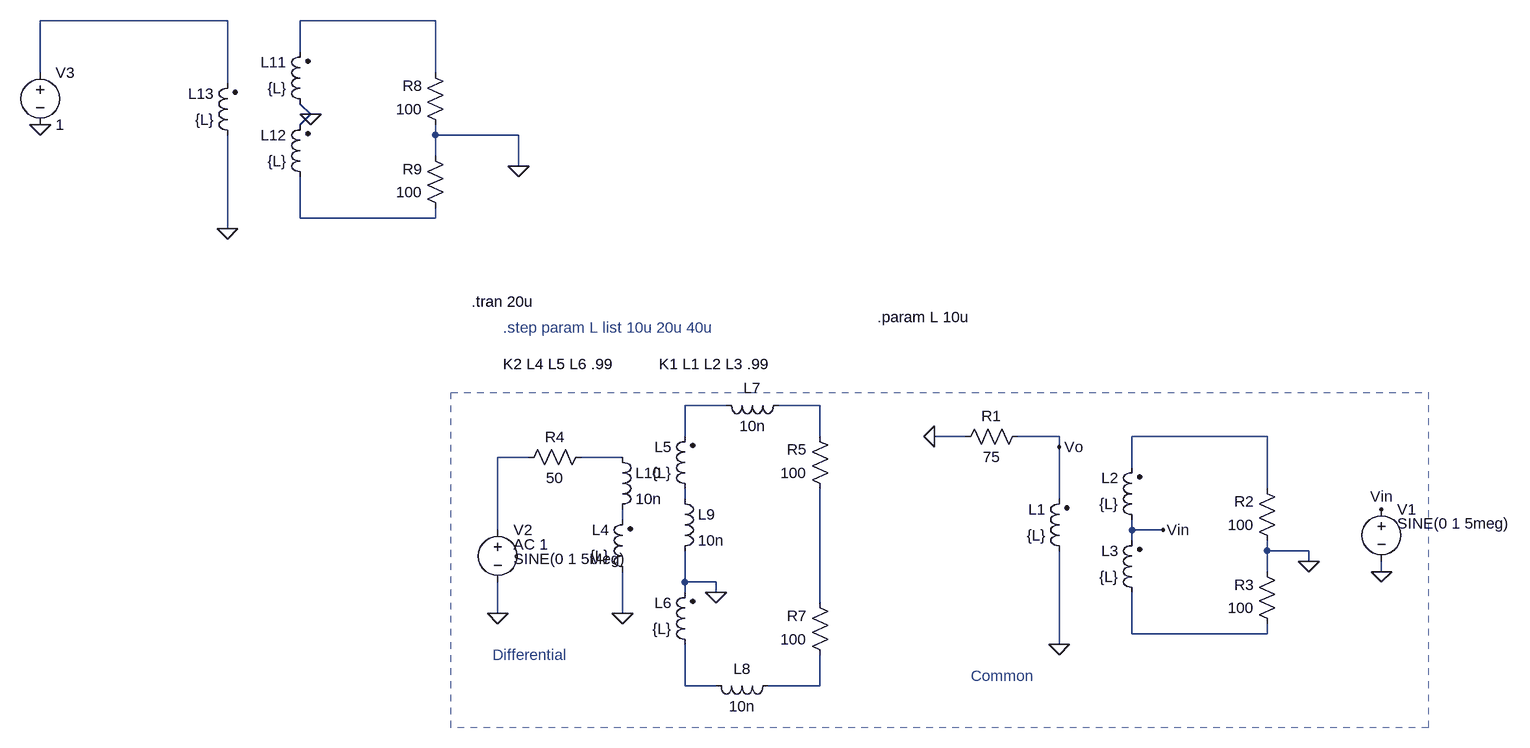
[diagram p0: schematic Trifilar.asc]
Trifilar.asc, the LTspice schematic file:
Version 4
SHEET 1 880 912
WIRE -1184 -592 -1472 -592
WIRE -864 -592 -1072 -592
WIRE -1072 -544 -1072 -592
WIRE -1472 -512 -1472 -592
WIRE -864 -512 -864 -592
WIRE -1184 -496 -1184 -592
WIRE -1056 -448 -1072 -464
WIRE -1072 -432 -1056 -448
WIRE -864 -416 -864 -432
WIRE -736 -416 -864 -416
WIRE -864 -384 -864 -416
WIRE -736 -368 -736 -416
WIRE -1072 -288 -1072 -352
WIRE -864 -288 -864 -304
WIRE -864 -288 -1072 -288
WIRE -1184 -272 -1184 -416
WIRE -416 0 -480 0
WIRE -272 0 -336 0
WIRE -480 48 -480 0
WIRE -272 48 -272 0
WIRE -48 48 -96 48
WIRE 96 48 32 48
WIRE 416 48 208 48
WIRE 96 64 96 48
WIRE -720 80 -768 80
WIRE -576 80 -640 80
WIRE 208 96 208 48
WIRE 416 128 416 48
WIRE -480 144 -480 128
WIRE 96 144 96 64
WIRE -576 176 -576 160
WIRE -768 192 -768 80
WIRE 208 192 208 176
WIRE 256 192 208 192
WIRE 208 208 208 192
WIRE 416 224 416 208
WIRE 480 224 416 224
WIRE 480 240 480 224
WIRE 416 256 416 224
WIRE 592 256 592 240
WIRE -480 272 -480 224
WIRE -432 272 -480 272
WIRE -480 288 -480 272
WIRE -432 288 -432 272
WIRE -272 304 -272 128
WIRE -768 320 -768 272
WIRE -576 320 -576 256
WIRE 208 352 208 288
WIRE 416 352 416 336
WIRE 416 352 208 352
WIRE 96 368 96 224
WIRE -480 432 -480 368
WIRE -432 432 -480 432
WIRE -272 432 -272 384
WIRE -272 432 -352 432
FLAG 592 256 0
FLAG 96 368 0
FLAG -768 320 0
FLAG -576 320 0
FLAG 592 160 Vin
FLAG 256 192 Vin
FLAG 480 240 0
FLAG -96 48 0
FLAG -432 288 0
FLAG 96 64 Vo
FLAG -1184 -272 0
FLAG -1472 -432 0
FLAG -736 -368 0
FLAG -1056 -448 0
SYMBOL ind2 224 192 R180
WINDOW 0 36 80 Left 2
WINDOW 3 36 40 Left 2
SYMATTR InstName L2
SYMATTR Value {L}
SYMATTR Type ind
SYMBOL ind2 224 304 R180
WINDOW 0 36 80 Left 2
WINDOW 3 36 40 Left 2
SYMATTR InstName L3
SYMATTR Value {L}
SYMATTR Type ind
SYMBOL voltage 592 144 R0
WINDOW 3 24 38 Left 2
SYMATTR Value SINE(0 1 5meg)
SYMATTR InstName V1
SYMATTR Value2 AC 1
SYMATTR SpiceLine Rser=50
SYMBOL res 48 32 R90
WINDOW 0 0 56 VBottom 2
WINDOW 3 32 56 VTop 2
SYMATTR InstName R1
SYMATTR Value 75
SYMBOL res 432 224 R180
WINDOW 0 36 76 Left 2
WINDOW 3 36 40 Left 2
SYMATTR InstName R2
SYMATTR Value 100
SYMBOL res 432 352 R180
WINDOW 0 36 76 Left 2
WINDOW 3 36 40 Left 2
SYMATTR InstName R3
SYMATTR Value 100
SYMBOL ind2 -464 144 R180
WINDOW 0 36 80 Left 2
WINDOW 3 36 40 Left 2
SYMATTR InstName L5
SYMATTR Value {L}
SYMATTR Type ind
SYMATTR SpiceLine Cpar=10p
SYMBOL ind2 -464 384 R180
WINDOW 0 36 80 Left 2
WINDOW 3 36 40 Left 2
SYMATTR InstName L6
SYMATTR Value {L}
SYMATTR Type ind
SYMATTR SpiceLine Cpar=10p
SYMBOL voltage -768 176 R0
WINDOW 123 24 38 Left 2
WINDOW 3 24 60 Left 2
SYMATTR Value2 AC 1
SYMATTR Value SINE(0 1 5Meg)
SYMATTR InstName V2
SYMBOL res -256 144 R180
WINDOW 0 36 76 Left 2
WINDOW 3 36 40 Left 2
SYMATTR InstName R5
SYMATTR Value 100
SYMBOL res -256 400 R180
WINDOW 0 36 76 Left 2
WINDOW 3 36 40 Left 2
SYMATTR InstName R7
SYMATTR Value 100
SYMBOL ind2 -560 272 R180
WINDOW 0 36 80 Left 2
WINDOW 3 36 40 Left 2
SYMATTR InstName L4
SYMATTR Value {L}
SYMATTR Type ind
SYMATTR SpiceLine Rpar=10 Cpar=10p
SYMBOL ind2 112 240 R180
WINDOW 0 36 80 Left 2
WINDOW 3 36 40 Left 2
SYMATTR InstName L1
SYMATTR Value {L}
SYMATTR Type ind
SYMBOL res -624 64 R90
WINDOW 0 0 56 VBottom 2
WINDOW 3 32 56 VTop 2
SYMATTR InstName R4
SYMATTR Value 50
SYMBOL ind -320 -16 R90
WINDOW 0 5 56 VBottom 2
WINDOW 3 32 56 VTop 2
SYMATTR InstName L7
SYMATTR Value 10n
SYMATTR SpiceLine Cpar=10p
SYMBOL ind -336 416 R90
WINDOW 0 5 56 VBottom 2
WINDOW 3 32 56 VTop 2
SYMATTR InstName L8
SYMATTR Value 10n
SYMATTR SpiceLine Cpar=10p
SYMBOL ind -496 128 R0
SYMATTR InstName L9
SYMATTR Value 10n
SYMATTR SpiceLine Cpar=15p
SYMBOL ind -592 64 R0
SYMATTR InstName L10
SYMATTR Value 10n
SYMATTR SpiceLine Cpar=50p
SYMBOL ind2 -1056 -448 R180
WINDOW 0 36 80 Left 2
WINDOW 3 36 40 Left 2
SYMATTR InstName L11
SYMATTR Value {L}
SYMATTR Type ind
SYMBOL ind2 -1056 -336 R180
WINDOW 0 36 80 Left 2
WINDOW 3 36 40 Left 2
SYMATTR InstName L12
SYMATTR Value {L}
SYMATTR Type ind
SYMBOL res -848 -416 R180
WINDOW 0 36 76 Left 2
WINDOW 3 36 40 Left 2
SYMATTR InstName R8
SYMATTR Value 100
SYMBOL res -848 -288 R180
WINDOW 0 36 76 Left 2
WINDOW 3 36 40 Left 2
SYMATTR InstName R9
SYMATTR Value 100
SYMBOL ind2 -1168 -400 R180
WINDOW 0 36 80 Left 2
WINDOW 3 36 40 Left 2
SYMATTR InstName L13
SYMATTR Value {L}
SYMATTR Type ind
SYMBOL voltage -1472 -528 R0
SYMATTR InstName V3
SYMATTR Value 1
TEXT -760 -120 Left 2 ;.step param L list 10u 20u 40u
TEXT -808 -160 Left 2 !.tran 20u
TEXT -520 -64 Left 2 !K1 L1 L2 L3 .99
TEXT -760 -64 Left 2 !K2 L4 L5 L6 .99
TEXT -776 384 Left 2 ;Differential
TEXT -40 416 Left 2 ;Common
TEXT -184 -136 Left 2 !.param L 10u
RECTANGLE Normal -840 -20 664 496 2

The netlist it stands for:
* Trifilar.asc
L2 Vin N006 {L}
L3 N012 Vin {L}
V1 Vin 0 SINE(0 1 5meg) AC 1 Rser=50
R1 Vo 0 75
R2 0 N006 100
R3 N012 0 100
L5 N009 N004 {L} Cpar=10p
L6 N013 0 {L} Cpar=10p
V2 N007 0 SINE(0 1 5Meg) AC 1
R5 N011 N005 100
R7 N014 N011 100
L4 0 N010 {L} Rpar=10 Cpar=10p
L1 0 Vo {L}
R4 N008 N007 50
L7 N005 N004 10n Cpar=10p
L8 N014 N013 10n Cpar=10p
L9 N009 0 10n Cpar=15p
L10 N008 N010 10n Cpar=50p
L11 0 N002 {L}
L12 N003 0 {L}
R8 0 N002 100
R9 N003 0 100
L13 0 N001 {L}
V3 N001 0 1
* .step param L list 10u 20u 40u
.tran 20u
K1 L1 L2 L3 .99
K2 L4 L5 L6 .99
* Differential
* Common
.param L 10u
.backanno
.end